# EAGLE schematic Venus638FLPX-L (EAGLE 6.3)
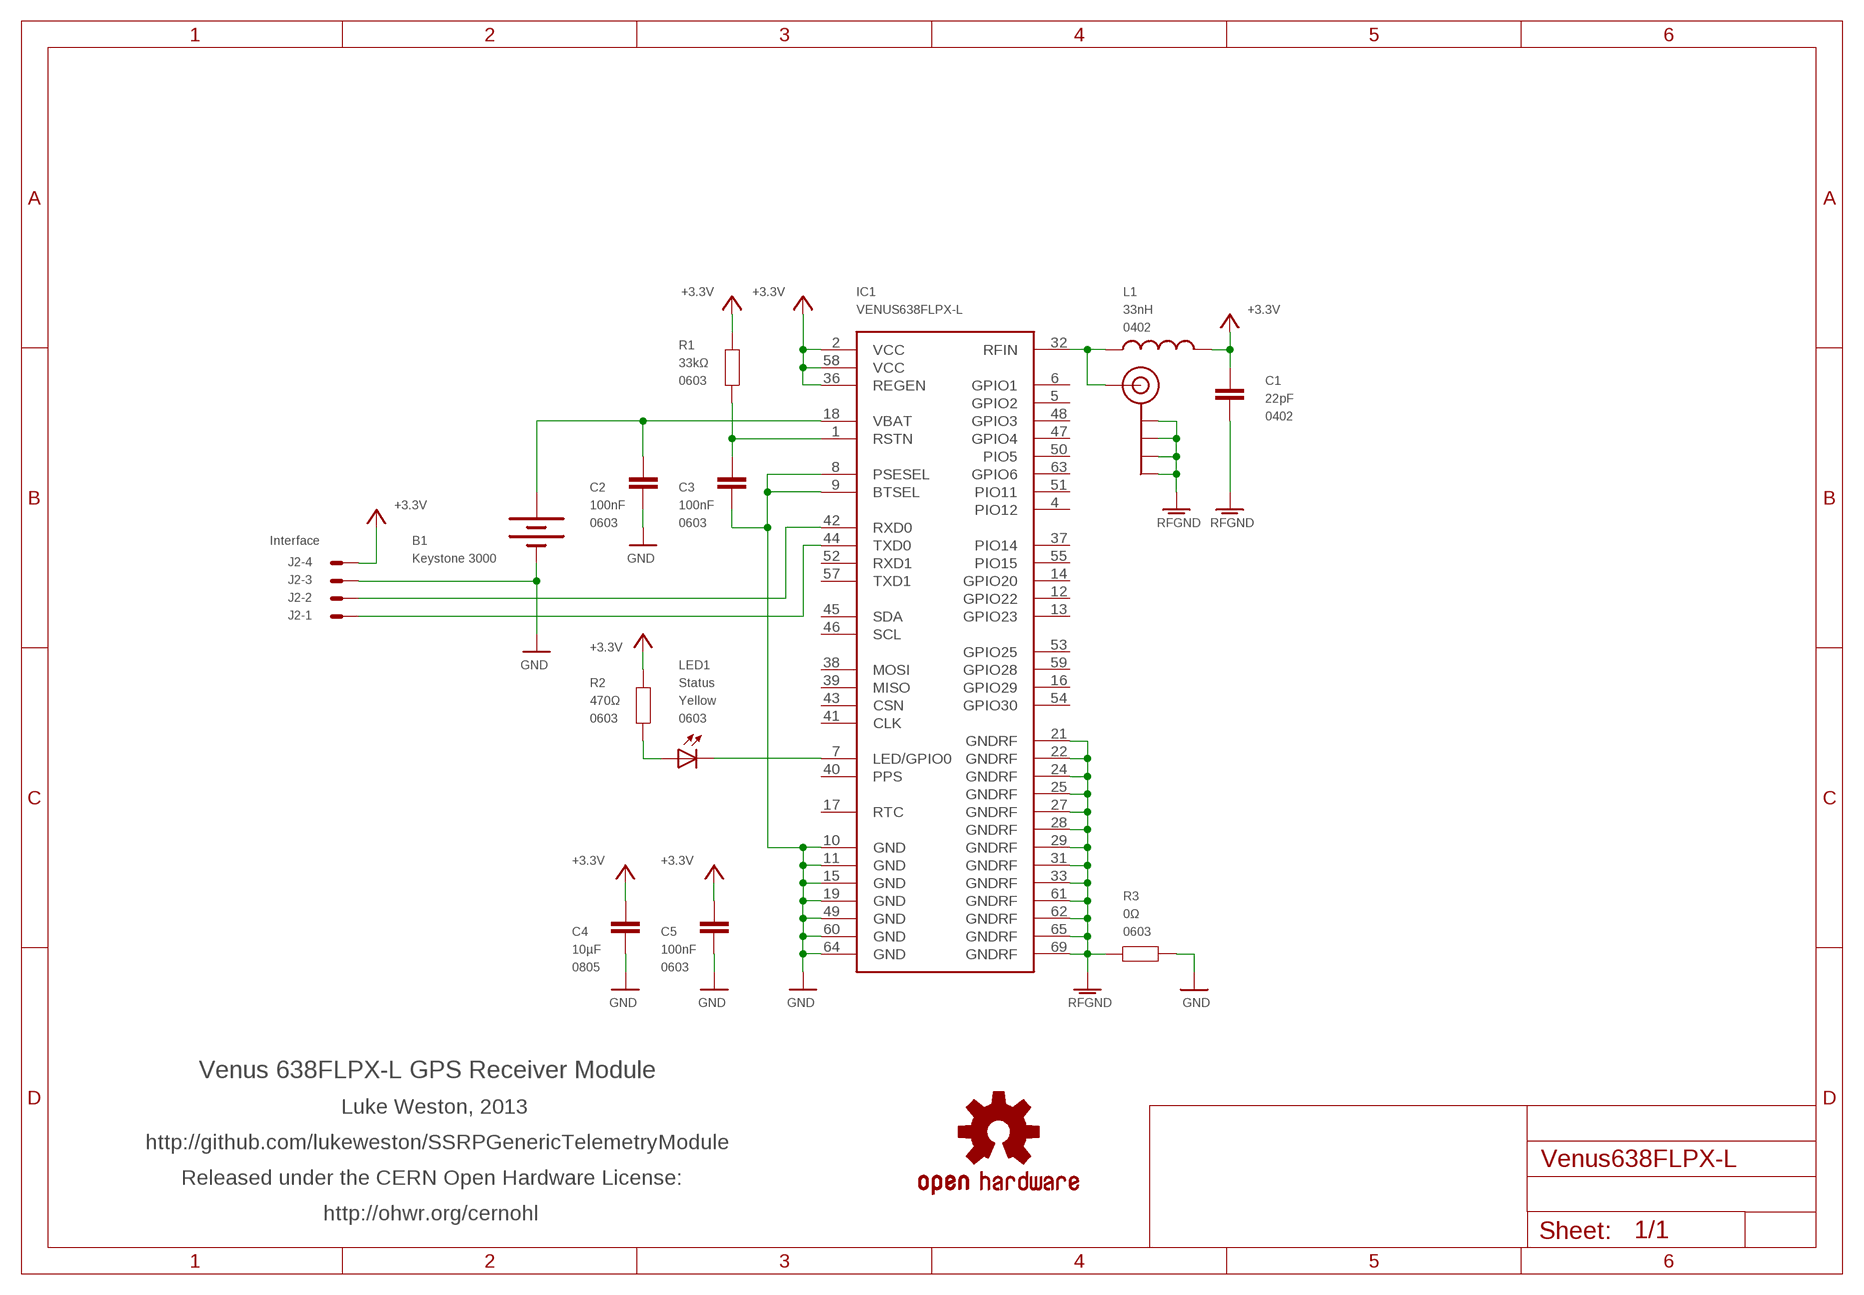
[diagram p0: schematic, sheet 1]

## Parts
B1  Keystone 3000  BATTERY12MM  [BATTCON_12MM]
C1  22pF  CAP0402  [C0402]
C2  100nF  CAP0603  [0603]
C3  100nF  CAP0603  [0603]
C4  10µF  CAP0805  [0805]
C5  100nF  CAP0603  [0603]
IC1  VENUS638FLPX-L  [VENUS638FLPX]
J1  Antenna  SMA_EDGE  [SMA-EDGE]
J2  Interface  22-23-2041  [22-23-2041]
L1  33nH  INDUCTOR0402  [C0402]
LED1  Status  LED0603  [LED-0603]
R1  33kΩ  RESISTOR0603  [0603]
R2  470Ω  RESISTOR0603  [0603]
R3  0Ω  RESISTOR0603  [0603]
SY  OSHW-LOGOS  [OSHW-LOGO-S]

## Nets
+3.3V: C1.2 C4.2 C5.2 IC1.2(VCC) IC1.36(REGEN) IC1.58(VCC) J2.4 L1.1 R1.1 R2.1
ANT2: IC1.32(RFIN) J1.SIG(SIGNAL) L1.2
GND: B1.GND(-) C2.1 C3.1 C4.1 C5.1 IC1.8(PSESEL) IC1.9(BTSEL) IC1.10(GND) IC1.11(GND) IC1.15(GND) IC1.19(GND) IC1.49(GND) IC1.60(GND) IC1.64(GND) J2.3 R3.1
N$1: C3.2 IC1.1(RSTN) R1.2
N$4: B1.PWR@1(+) C2.2 IC1.18(VBAT)
N$28: IC1.7(LED/GPIO0) LED1.C
N$31: LED1.A R2.2
RFGND: C1.1 IC1.21(GNDRF) IC1.22(GNDRF) IC1.24(GNDRF) IC1.25(GNDRF) IC1.27(GNDRF) IC1.28(GNDRF) IC1.29(GNDRF) IC1.31(GNDRF) IC1.33(GNDRF) IC1.61(GNDRF) IC1.62(GNDRF) IC1.65(GNDRF) IC1.69(GNDRF) J1.GND@0(GND) J1.GND@1(GND) J1.GND@2(GND) J1.GND@3(GND) R3.2
RXD: IC1.42(RXD0) J2.2
TXD: IC1.44(TXD0) J2.1
Unconnected: IC1.4(PIO12) IC1.5(GPIO2) IC1.6(GPIO1) IC1.12(GPIO22) IC1.13(GPIO23) IC1.14(GPIO20) IC1.16(GPIO29) IC1.17(RTC) IC1.37(PIO14) IC1.38(MOSI) IC1.39(MISO) IC1.40(PPS) IC1.41(CLK) IC1.43(CSN) IC1.45(SDA) IC1.46(SCL) IC1.47(GPIO4) IC1.48(GPIO3) IC1.50(PIO5) IC1.51(PIO11) IC1.52(RXD1) IC1.53(GPIO25) IC1.54(GPIO30) IC1.55(PIO15) IC1.57(TXD1) IC1.59(GPIO28) IC1.63(GPIO6)

## Notes on the sheet
- Venus 638FLPX-L GPS Receiver Module
- Luke Weston, 2013
- http://github.com/lukeweston/SSRPGenericTelemetryModule
- Released under the CERN Open Hardware License:
- http://ohwr.org/cernohl

## Library data of the parts
B1 = SparkFun:BATTERY: Battery Holders Various common sizes : AA, AAA, 20mm coin cell and 12mm coin cell.
C1 = freetronics-master-v1:CAP: Capacitor Standard 0603 ceramic capacitor, and 0.1" leaded capacitor.; PACKAGE: 0402
C2 C3 C5 = freetronics-master-v1:CAP: Capacitor Standard 0603 ceramic capacitor, and 0.1" leaded capacitor.; PACKAGE: 0603
C4 = freetronics-master-v1:CAP: Capacitor Standard 0603 ceramic capacitor, and 0.1" leaded capacitor.; PACKAGE: 0805
IC1 = mike-temp:VENUS638FLPX-L: Venus638FLPX-L GPS Receiver Venus638FLPx is a high performance, low cost, single chip GPS receiver targeting mobile consumer and cellular handset applications. It offers very low power consumption, high sensitivity, and best in class signal acquisition and time-to-first-fix performance. Venus638FLPx contains all the necessary components of a complete GPS receiver, includes 1.2dB cascaded system NF RF front-end, GPS baseband signal processor, 0.5ppm TCXO, 32.768kHz RTC crystal, RTC LDO regulator, and passive components. It requires very low external component count and takes up only 100mm2 PCB footprint. Dedicated massive-correlator signal parameter search engine within the baseband enables rapid search of all the available satellites and acquisition of very weak signal. An advanced track engine allows weak signal tracking and positioning in harsh environments such as urban canyons and under deep foliage. The self-contained architecture keeps GPS processing off the host and allows integration into applications with very little resource. FEATURES 20Hz update rate -148dBm cold start sensitivity -165dBm tracking sensitivity 29 second cold start TTFF 3.5 second TTFF with AGPS 1 second hot start 2.5m accuracy Multipath detection and suppression Jamming detection and mitigation SBAS (WAAS / EGNOS) support 7-day extended ephemeris AGPS 67mW full power navigation Works directly with active or passive antenna Internal flash for optional 75K point data logging Supports external SPI flash memory data logging Complete receiver in 10mm x 10mm x 1.3mm size Contains LNA, SAW Filter, TCXO, RTC Xtal, LDO Pb-free RoHS compliant
J1 = SparkFun:SMA_EDGE: SMA Antenna Connector End launch SMA connector. The paste layer has been removed so that the connector can be hand soldered onto the board after reflow.
J2 = con-molex:22-23-2041: .100" (2.54mm) Center Header - 4 Pin; MF: MOLEX; MPN: 22-23-2041; OC_FARNELL: 1462920; OC_NEWARK: 38C0355
L1 = SparkFun:INDUCTOR: Inductors Basic Inductor/Choke - 0603 and 1206. Footprints are not proven and vary greatly between part numbers.; PACKAGE: 0402
LED1 = freetronics-master-v1:LED: LEDs Standard schematic elements and footprints for 5mm, 3mm, 1206, and 0603 sized LEDs. 5mm - Spark Fun Electronics SKU : COM-00529 (and others); COLOUR: Yellow; PACKAGE: 0603
R1-R3 = freetronics-master-v1:RESISTOR: Resistor Basic schematic elements and footprints for 0603, 1206, and PTH 1/10th watt (small) resistors.; PACKAGE: 0603
SY = SparkFun:OSHW-LOGO: Open Source Hardware Logo This logo indicates the piece of hardware it is found on incorporates a OSHW license and/or adheres to the definition of open source hardware found here: http://freedomdefined.org/OSHW